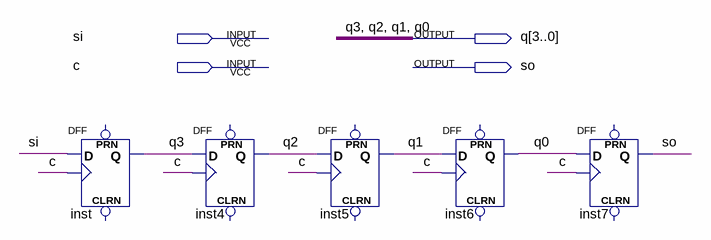
[diagram p0: schematic sheet]
// Quartus schematic s62_shift_reg.bdf as structural Verilog: 5 symbols, 4 pins
module s62_shift_reg (
  input  si,
  input  c,
  output [3:0] q,
  output so
);

  DFF inst (.CLK(c), .D(si), .Q(q[3]));  // open: CLRN, PRN
  DFF inst4 (.CLK(c), .D(q[3]), .Q(q[2]));  // open: CLRN, PRN
  DFF inst5 (.CLK(c), .D(q[2]), .Q(q[1]));  // open: CLRN, PRN
  DFF inst6 (.CLK(c), .D(q[1]), .Q(q[0]));  // open: CLRN, PRN
  DFF inst7 (.CLK(c), .D(q[0]), .Q(so));  // open: CLRN, PRN
endmodule
